# Altium schematic sheet Sheet1.SchDoc
size A3
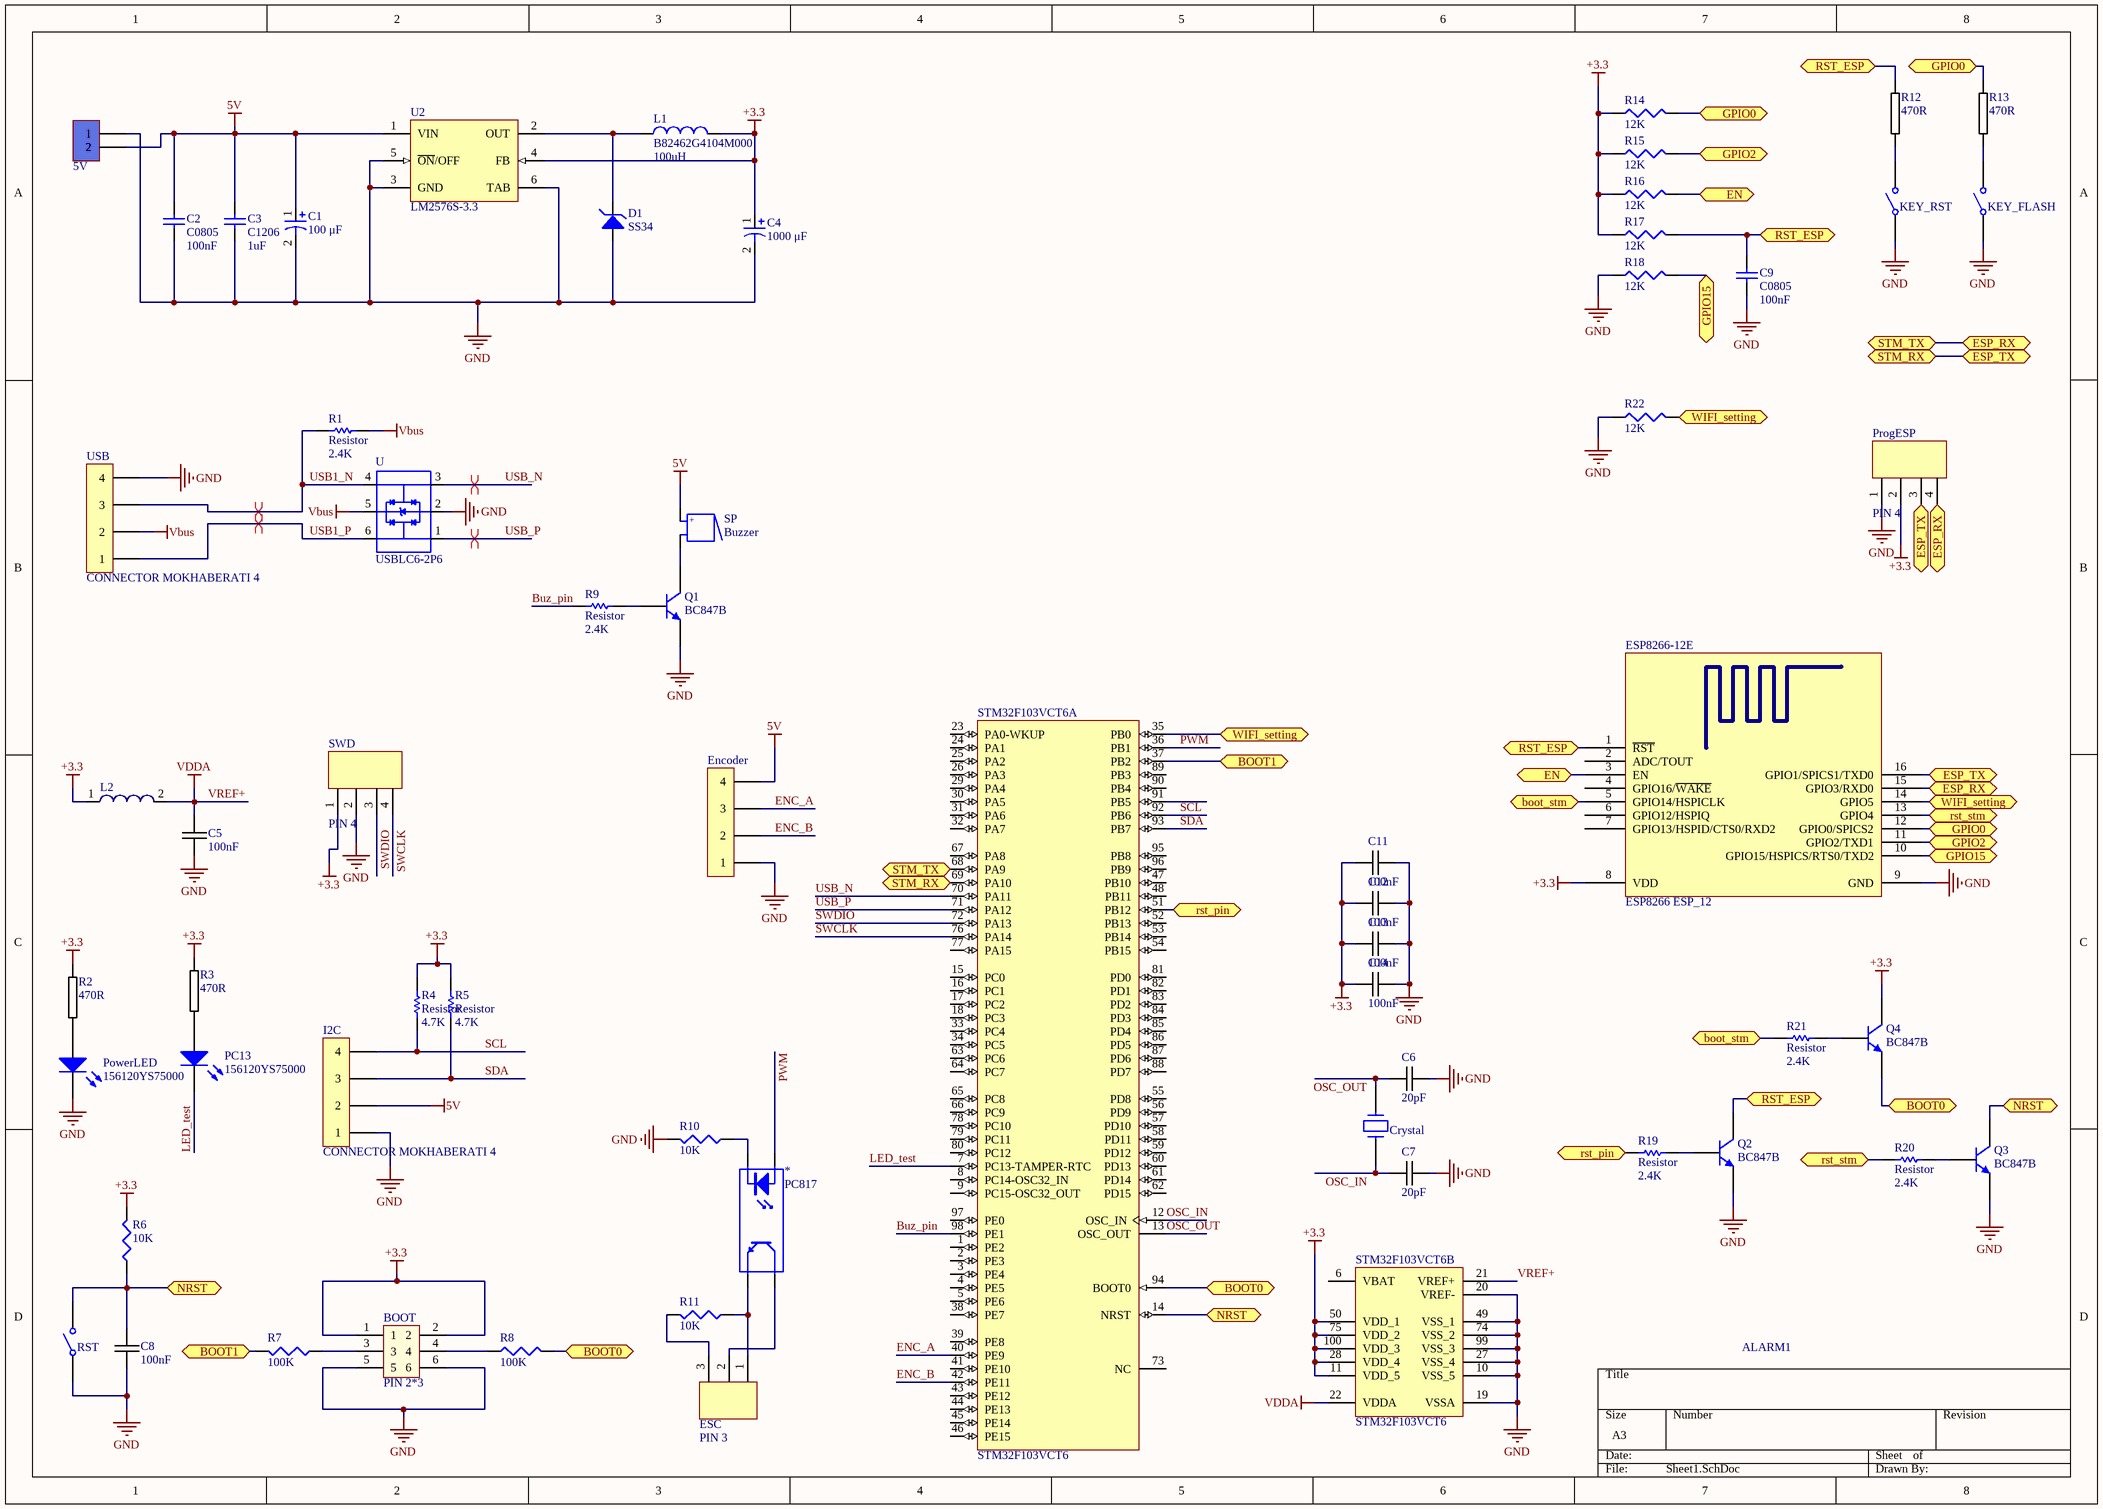
[diagram p0: Sheet1.SchDoc]

## Parts
5V  KF301-2Pin Terminal  [KF301 2PIN]  (value not drawn)
*  PC817  [PC817]
ALARM1  Warning!  [LOGO SPEAKER]  (value not drawn)  (no BOM)
BOOT  PIN 2*3  [PIN 2*3]
C1  100 μF  [WCAP-AS5H 8x10.5x3.1]
C2  C0805  value 100nF  [0805]
C3  C1206  value 1uF  [1206]
C4  1000 μF  [WCAP-AS5H 8x10.5x3.1]
C5  100nF  [0805C-TBD]
C6  20pF  [0603C-GENERIC]
C7  20pF  [0603C-GENERIC]
C8  100nF  [0805C-TBD]
C9  C0805  value 100nF  [0805]
C11  100nF  [0805C-TBD]
C12  100nF  [0805C-TBD]
C13  100nF  [0805C-TBD]
C14  100nF  [0805C-TBD]
Crystal  Crystal  [Crystal_1]  (value not drawn)
D1  SS34  [DO-214AC_Unidirectional]
Encoder  CONNECTOR MOKHABERATI 4  [CONNECTOR 4PIN]  (value not drawn)
ESC  PIN 3  [pin 3]
ESP8266-12E  ESP8266 ESP_12  [ESP8266 ESP_12]
I2C  CONNECTOR MOKHABERATI 4  [CONNECTOR 4PIN]
KEY_FLASH  WE-Tact Switches WS-TASV 434121043836  [434121043836]  (value not drawn)
KEY_RST  WE-Tact Switches WS-TASV 434121043836  [434121043836]  (value not drawn)
L1  B82462G4104M000  value 100uH  [B82462G4]
L2  32 Ohm  [SMD 1206]  (value not drawn)
PC13  156120YS75000  [1206  RECTANGULAR-REVERSE USE]
PowerLED  156120YS75000  [1206  RECTANGULAR-REVERSE USE]
ProgESP  PIN 4  [PIN F4]
Q1  BC847B  [SOT23_N]
Q2  BC847B  [SOT23_N]
Q3  BC847B  [SOT23_N]
Q4  BC847B  [SOT23_N]
R1  Resistor  value 2.4K  [Resistor_SMD_2010 (5025)]
R2  470R  [0603R-470]
R3  470R  [0603R-470]
R4  Resistor  value 4.7K  [Resistor_SMD_1206 (3216)]
R5  Resistor  value 4.7K  [Resistor_SMD_1206 (3216)]
R6  10K  [R 1206]
R7  100K  [R 1206]
R8  100K  [R 1206]
R9  Resistor  value 2.4K  [Resistor_SMD_2010 (5025)]
R10  10K  [R 1206]
R11  10K  [R 1206]
R12  470R  [0603R-470]
R13  470R  [0603R-470]
R14  12K  [R 1206]
R15  12K  [R 1206]
R16  12K  [R 1206]
R17  12K  [R 1206]
R18  12K  [R 1206]
R19  Resistor  value 2.4K  [Resistor_SMD_2010 (5025)]
R20  Resistor  value 2.4K  [Resistor_SMD_2010 (5025)]
R21  Resistor  value 2.4K  [Resistor_SMD_2010 (5025)]
R22  12K  [R 1206]
RST  WE-Tact Switches WS-TASV 434121043836  [434121043836]  (value not drawn)
SP  Buzzer  [BZ_SJ]
STM32F103VCT6  STM32F103VCT6  [STM-LQFP100_M]  (parts A,B of 2)
SWD  PIN 4  [pin 4]
U  USBLC6-2P6  [SOT50P160X60-6N]
U2  LM2576S-3.3  [TS5B_N]
USB  CONNECTOR MOKHABERATI 4  [CONNECTOR 4PIN]

## Ports
BOOT0, BOOT1, boot_stm, EN, ESP_RX, ESP_TX, GPIO0, GPIO2, GPIO15, NRST, RST_ESP, rst_pin, rst_stm, STM_RX, STM_TX, WIFI_setting

## Nets
5V: 5V.2 C1.1 C2.2 C3.2 Encoder.4 I2C.2 SP.1(+) U2.1(VIN)
+3.3: BOOT.1 BOOT.2 C4.1 C11.1 C12.1 C13.1 C14.1 ESP8266-12E.8(VDD) L1.2 L2.1 ProgESP.2 Q4.3(C) R2.1 R3.1 R4.2 R5.2 R6.2 R14.1 R15.1 R16.1 R17.1 STM32F103VCT6.11(VDD_5) STM32F103VCT6.28(VDD_4) STM32F103VCT6.50(VDD_1) STM32F103VCT6.75(VDD_2) STM32F103VCT6.100(VDD_3) SWD.1 U2.4(FB)
GND: 5V.1 BOOT.5 BOOT.6 C1.2 C2.1 C3.1 C4.2 C5.2 C6.2 C7.2 C8.2 C9.1 C11.2 C12.2 C13.2 C14.2 D1.2 Encoder.1 ESP8266-12E.9(GND) I2C.1 KEY_FLASH.1 KEY_RST.1 PowerLED.1(K) ProgESP.1 Q1.2(E) Q2.2(E) Q3.2(E) R10.2 R18.1 R22.1 RST.1 STM32F103VCT6.10(VSS_5) STM32F103VCT6.19(VSSA) STM32F103VCT6.20(VREF-) STM32F103VCT6.27(VSS_4) STM32F103VCT6.49(VSS_1) STM32F103VCT6.74(VSS_2) STM32F103VCT6.99(VSS_3) SWD.2 U.2(GND) U2.3(GND) U2.5(~{ON}/OFF) U2.6(TAB) USB.4
Vbus: R1.2 U.5(VBUS) USB.2
VREF+: C5.1 L2.2 STM32F103VCT6.21(VREF+) STM32F103VCT6.22(VDDA)  [also labelled VDDA]
BOOT0: Q4.2(E) R8.2 STM32F103VCT6.94(BOOT0) ; port BOOT0
BOOT1: R7.2 STM32F103VCT6.37(PB2) ; port BOOT1
boot_stm: ESP8266-12E.5(GPIO14/HSPICLK) R21.1 ; port boot_stm
Buz_pin: R9.1 STM32F103VCT6.98(PE1)
EN: ESP8266-12E.3(EN) R16.2 ; port EN
ENC_A: Encoder.3 STM32F103VCT6.40(PE9)
ENC_B: Encoder.2 STM32F103VCT6.42(PE11)
ESP_RX: ESP8266-12E.15(GPIO3/RXD0) ProgESP.4 STM32F103VCT6.68(PA9) ; port STM_TX, port ESP_RX
ESP_TX: ESP8266-12E.16(GPIO1/SPICS1/TXD0) ProgESP.3 STM32F103VCT6.69(PA10) ; port STM_RX, port ESP_TX
GPIO0: ESP8266-12E.12(GPIO0/SPICS2) R13.1 R14.2 ; port GPIO0
GPIO2: ESP8266-12E.11(GPIO2/TXD1) R15.2 ; port GPIO2
GPIO15: ESP8266-12E.10(GPIO15/HSPICS/RTS0/TXD2) R18.2 ; port GPIO15
LED_test: PC13.1(K) STM32F103VCT6.7(PC13-TAMPER-RTC)
NRST: C8.1 Q3.3(C) R6.1 RST.2 STM32F103VCT6.14(NRST) ; port NRST
OSC_IN: C7.1 Crystal.1 STM32F103VCT6.12(OSC_IN)
OSC_OUT: C6.1 Crystal.2 STM32F103VCT6.13(OSC_OUT)
PWM: *.1(A) STM32F103VCT6.36(PB1)
RST_ESP: C9.2 ESP8266-12E.1(~{RST}) Q2.3(C) R12.1 R17.2 ; port RST_ESP
rst_pin: R19.1 STM32F103VCT6.51(PB12) ; port rst_pin
rst_stm: ESP8266-12E.13(GPIO4) R20.1 ; port rst_stm
SCL: I2C.4 R4.1 STM32F103VCT6.92(PB6)
SDA: I2C.3 R5.1 STM32F103VCT6.93(PB7)
SWCLK: STM32F103VCT6.76(PA14) SWD.4
SWDIO: STM32F103VCT6.72(PA13) SWD.3
USB1_N: R1.1 U.4(I/O2_2) USB.3
USB1_P: U.6(I/O1_2) USB.1
USB_N: STM32F103VCT6.70(PA11) U.3(I/O2_1)
USB_P: STM32F103VCT6.71(PA12) U.1(I/O1_1)
WIFI_setting: ESP8266-12E.14(GPIO5) R22.2 STM32F103VCT6.35(PB0) ; port WIFI_setting
Net*_2: *.2(K) R10.1
Net*_3: *.3(E) ESC.1 R11.1
Net*_4: *.4(C) ESC.2
NetBOOT_3: BOOT.3 R7.1
NetBOOT_4: BOOT.4 R8.1
NetD1_1: D1.1 L1.1 U2.2(OUT)
NetESC_3: ESC.3 R11.2
NetKEY_FLASH_2: KEY_FLASH.2 R13.2
NetKEY_RST_2: KEY_RST.2 R12.2
NetPC13_2: PC13.2(A) R3.2
NetPowerLED_2: PowerLED.2(A) R2.2
NetQ1_1: Q1.1(B) R9.2
NetQ1_3: Q1.3(C) SP.2(-)
NetQ2_1: Q2.1(B) R19.2
NetQ3_1: Q3.1(B) R20.2
NetQ4_1: Q4.1(B) R21.2

Not connected (* = marked no-connect by the designer): ESP8266-12E 2(ADC/TOUT) 4(GPIO16/~{WAKE}) 6(GPIO12/HSPIQ) 7(GPIO13/HSPID/CTS0/RXD2); STM32F103VCT6 1(PE2) 2(PE3) 3(PE4) 4(PE5) 5(PE6) 6(VBAT) 8(PC14-OSC32_IN) 9(PC15-OSC32_OUT) 15(PC0) 16(PC1) 17(PC2) 18(PC3) 23(PA0-WKUP) 24(PA1) 25(PA2) 26(PA3) 29(PA4) 30(PA5) 31(PA6) 32(PA7) 33(PC4) 34(PC5) 38(PE7) 39(PE8) 41(PE10) 43(PE12) 44(PE13) 45(PE14) 46(PE15) 47(PB10) 48(PB11) 52(PB13) 53(PB14) 54(PB15) 55(PD8) 56(PD9) 57(PD10) 58(PD11) 59(PD12) 60(PD13) 61(PD14) 62(PD15) 63(PC6) 64(PC7) 65(PC8) 66(PC9) 67(PA8) 73(NC) 77(PA15) 78(PC10) 79(PC11) 80(PC12) 81(PD0) 82(PD1) 83(PD2) 84(PD3) 85(PD4) 86(PD5) 87(PD6) 88(PD7) 89(PB3) 90(PB4) 91(PB5) 95(PB8) 96(PB9) 97(PE0)

## Layout directives
differential pair: USB1_N, USB1_P, USB_N, USB_P

## Library data of the parts
5V = KF301-2Pin Terminal: Terminal 2 Pin 250VAC 16A; Part. No: KF301 2P; Designer: Abbas Basereh; Link: https://www.aliexpress.com/item/
ALARM1 = WARNING: Alarm Logo; Company: E.P.I.L; Design Date: 11/6/2011; Value: Warning!
C1 C4 = WCAP-AS5H 8x10.5x3.1 865230253005: WCAP-AS5H Aluminum Electrolytic Capacitors , 220 μF; + / - 20%; 10 V , 8 x 10,5; Manufacturer: Wurth Elektronik; E-mail: libraries@we-online.com; Characteristics: Aluminum Electrolytic Capacitor; Recommended soldering: Reflow; Operating temperature: –40 °C to +105 °C; Long life product series; Load life: 5000 h @ +105 °C; ComponentLink1Description: Manufacturer; ComponentLink1URL: http://www.we-online.com; ComponentLink2Description: Datasheet; ComponentLink2URL: http://katalog.we-online.de/pbs/datasheet/865230253005.pdf; Created by: Karrer Zheng; Created Date: 6/12/2015; Application: Applied to circuit with higher requirements for long life, and can be use for filtering in switching power supply, DC-DC power supply module,conversion adapter, charger, DC motor circuit filter, digital audio, digital TV, digital camera, digital video camera, satellite receivers, equipment control panel power supply and etc.; partNo: 865230253005
  C1: Capacitance: 100 μF
  C4: Capacitance: 1000 μF
C2 C9 = C0805: Ceramic Chip Capacitor - Standard; Note: Footprint corresponds to dimensions for bulk cassette packaging. This case size has tightened tolerances.; Published: 17-Jul-2002; LatestRevisionDate: 19-Mar-2004; LatestRevisionNote: Silkscreen size reduced.; DatasheetDocument: Mar-2001; PackageDocument: Mar-2001; PackageReference: 0805; Publisher: Altium Limited; Code_JEITA: 0805; Code_IPC: 2012[0805]; ComponentLink1Description: Manufacturer Link; ComponentLink1URL: http://www.kemet.com/; ComponentLink2Description: Datasheet; ComponentLink2URL: http://www.kemet.com/kemet/web/homepage/kechome.nsf/vapubfilesname/F3102TA.pdf/$file/F3102TA.pdf
C3 = C1206: Ceramic Chip Capacitor - Standard; Published: 17-Jul-2002; LatestRevisionDate: 19-Mar-2004; LatestRevisionNote: Silkscreen size reduced.; DatasheetDocument: Mar-2001; PackageDocument: Mar-2001; PackageReference: 1206; Publisher: Altium Limited; Code_JEITA: 1206; Code_IPC: 3216 [1206]; ComponentLink1Description: Manufacturer Link; ComponentLink1URL: http://www.kemet.com/; ComponentLink2Description: Datasheet; ComponentLink2URL: http://www.kemet.com/kemet/web/homepage/kechome.nsf/vapubfilesname/F3102TA.pdf/$file/F3102TA.pdf
C5 C8 C11-C14 = 0805C-100nF-25V-X7R-MUR: CAPACITOR 0805 CERAMIC; Supplier 1: Digi-Key; Supplier Part Number 1: 490-1673-1-ND
C6 C7 = 0603C-000: CAPACITOR 0603 CERAMIC
Crystal = Crystal..: LatestRevisionDate: 17-Jul-2002; LatestRevisionNote: Re-released for DXP Platform.; Publisher: Altium Limited
D1 = TVS Diode, Unidirectional DO-214AC, 824500101: WE-TVSP Power TVS Diode, Unidirectional, 400 W, 10 VDC; Manufacturer: Wurth Elektronik; partNo: 824500101; ComponentLink1Description: Manufacturer; ComponentLink1URL: http://www.we-online.de; Created by: Baojun Chen; Created Date: Nov.2015; ComponentLink2Description: Datasheet; ComponentLink2URL: http://katalog.we-online.de/pbs/datasheet/824500101.pdf
ESP8266-12E = ESP8266 ESP_12: ESP8266 ESP-12; IC: ESP8266-EX; Vendor: Ai-thinker; LatestReviewer: Zion Blue; Published: 14-Apr-2015; Publisher: Cynetik Group; LatestRevisionData: 14-Apr-2015; LatestRevisionNote: Include 3D body and Footprint
KEY_FLASH KEY_RST RST = WE-Tact Switches WS-TASV 434121043836: WS-TASV SMD Tact Switch 6.0X3.5 mm; Manufacturer: W¨¹rth Elektronik eiSos GmbH & Co.KG; ComponentLink1 Description: Manufacturer; ComponentLink2 Description: Datasheet; Creat by: Karrer Zheng; NoPins: 02; Creat Date: 5 March February 2014; partNo: 434121043836; ComponentLink1URL: http://www.we-online.com; ComponentLink2URL: http://katalog.we-online.de/em/datasheet/434121043836.pdf
L1 = B82462G4104M000: SMT Power Inductor; Size 6.3×6.3×3.0mm, ±20% Tolerance, 100uH, 0.53A; PCB_Layout: Complies with manufacturer's recommendation.; Published: 26-Sep-2008; DatasheetVersion: Mar-2008; PackageVersion: Mar-2008; PackageReference: B82462G4; Publisher: Altium Limited; PackageDescription: SM Power Inductor; 2 Leads; Body 6.3 x 6.3 x 3.0 mm (LxWxH); ComponentLink1Description: Manufacturer Link; ComponentLink1URL: http://www.epcos.com/; ComponentLink2Description: Datasheet; ComponentLink2URL: http://www.epcos.com/inf/30/db/ind_2008/b82462g4.pdf
L2 = WE-CBF 1206, 7427921: SMD EMI Suppression Ferrite Beads WE-CBF, Z= 32 Ohm; Manufacturer: Würth Elektronik eiSos GmbH; partNo: 7427921; Impedance: 32 Ohm; ComponentLink1Description: Manufacturer; ComponentLink1URL: http://www.we-online.de; Created by: Christin Zierenner; Created Date: May 2009; ComponentLink2Description: Datasheet; ComponentLink2URL: http://www.we-online.de/katalog/media/pdf/7427921.pdf
PC13 PowerLED = WL-SMRW 1206  156120YS75000  Reverse Use: SMD mono-color reverse mount waterclear Chip LED, WL-SMRW, Yellow; Manufacturer: Würth Elektronik eiSos GmbH; Lens Type: Rectangular; PartNo: 156120YS75000; ComponentLink1Description: Manufacturer; ComponentLink1URL: http://www.we-online.de; Created by: Christin Otto; Created Date: June 2013; ComponentLink2Description: Datasheet; ComponentLink2URL: http://katalog.we-online.com/led/datasheet/156120YS75000.pdf; Color: Yellow
Q1-Q4 = BC847B: NPN General-purpose Transistor; Published: 17-Sep-2003; LatestRevisionDate: 12-Dec-2006; LatestRevisionNote: IPC-7351 Footprint Added.; DatasheetVersion: 4-Feb-2002; PackageVersion: May-1999; PackageReference: SOT23; Publisher: Altium Limited; PackageDescription: 3-Pin SOT-23 Package 0.95 mm Pitch, 2.3 mm Lead Span; ComponentLink1Description: Manufacturer Link; ComponentLink1URL: http://www.semiconductors.philips.com/; ComponentLink2Description: Datasheet; ComponentLink2URL: http://www.semiconductors.philips.com/acrobat/datasheets/BC846_BC847_BC848_5.pdf
R1 R4 R5 R9 R19-R21 = Resistor: Email: razi.vesali@gmail.com; Published: 17-Jun-2016; LatestRevisionNote: Re-released for puplic; Publisher: Seyed Razi Vesali
R2 R3 R12 R13 = 0603R-470: GENERIC RESISTOR 0603; Manufacturer Part Number: RMCF 1/16 470 1% R; Manufacturer: Stackpole Electronics Inc; Tolerance: ±1%; Power (Watts): 0.1W, 1/10W; Temperature Coefficient: ±100ppm/°C; Resistance In Ohms: 470; Reel: R17; Supplier 1: Digi-Key; Supplier Part Number 1: RMCF1/16470FRTR-ND; Supplier: Digi-Key; Composition: Thick Film; Packaging: Tape & Reel (TR); Lead Style: Surface Mount (SMD - SMT); Category: Resistors; RoHS: RoHS Compliant; Supplier Part Number: RMCF1/16470FRTR-ND; Case: 0603 (1608 metric)
R6-R8 R10 R11 R14-R18 R22 = R 1206
SP = Buzzer: Magnetic Transducer Buzzer; Company: SJ Libraries; Designer: Eng. Saeid Jorablo; PackageReference: ABSM-1574; PackageDescription: Magnetic Transducer Buzzer; Mounting Technology: Surface Mount\Through-Hole; ComponentLink1Description: Datasheet; Pin Count: 0; Category: MISC; HelpURL: http://s3.picofile.com/file/7443264187/Coming_Soon_logo.gif; ComponentLink2Description: Reference; Publisher: SJ Unlimited; Status: Unreleased
STM32F103VCT6 = STM32F103VCT6: ARM Cortex-M3 32-bit MCU, 256 KB Flash, 48 KB Internal RAM, 80 I/Os, 100-pin LQFP, -40 to 85 degC, Tray; A/D Converter: 3x12-bit (16 Channel); D/A Converter: 2x12-bit (2 Channel); FLASH Size (Prog) (kB): 256; I/Os (High Current): 80; Internal RAM Size (kB): 48; Operating Frequency(F) (Processor speed) (MHz): 72; Supply Voltage(Vcc) min (V): 2; DatasheetVersion: Rev. 8; PackageVersion: Rev. 1, 06/2013; PackageReference: LQFP100; PackageDescription: 100-Pin Low Profile Quad Flat Package, 14 x 14 mm Body, 0.5 mm Pitch; Supplier 1: Digi-Key; Supplier Part Number 1: 497-9034-ND; Supplier 2: Farnell; Supplier Part Number 2: 1624139; Supplier 3: Newark; Supplier Part Number 3: 57P1255; Supplier 4: Mouser; Supplier Part Number 4: 511-STM32F103VCT6; Core: ARM Cortex-M3; Packing: Tray; Mounting Technology: Surface Mount; PartNumber: STM32F103VCT6; ComponentLink1Description: Manufacturer URL; ComponentLink1URL: http://www.st.com/web/en/home.html; ComponentLink2Description: Datasheet; ComponentLink2URL: http://www.st.com/st-web-ui/static/active/en/resource/technical/document/datasheet/CD00191185.pdf; ComponentLink3Description: Package Specification; ComponentLink3URL: http://www.st.com/st-web-ui/static/active/en/resource/technical/document/data_brief/DM00071938.pdf
U = USBLC6-2P6: 17V Clamp 5A _8/20Âµs_ Ipp Tvs Diode Surface Mount SOT-666; MF: STMicroelectronics; Value: *; MP: USBLC6-2P6; SnapEDA_Link: https://www.snapeda.com/parts/USBLC6-2P6/STMicroelectronics/view-part/106846/?ref=snap; Availability: Unavailable; Price: None; Package: SOT-563 STMicroelectronics
U2 = LM2576S-3.3: SIMPLE SWITCHER; 3A Step-Down Voltage Regulator; Manufacturer: National Semiconductor; PackageTopMarking: NSUZXYTT*LM2576S*-3.3 P+; PowerWise: N; FirstPublished: 4-Dec-2008; DatasheetVersion: Aug-2004; PackageVersion: revD, Apr-2005; PackageReference: TS5B; Publisher: Altium Limited; PackageDescription: TO-263, Molded, .400 x .390 x .180in, 5 Lead, .067in Pitch, Surface Mount; CompType: Switcher; PartNumber: LM2576S-3.3; RoHS: Y; PinCount: 5; DigiKeyPartNumber: LM2576S-3.3-ND; Code_JEDEC: MO-169-AB; ComponentLink1Description: LM2576 Datasheet; ComponentLink1URL: http://www.national.com/ds/LM/LM2576.pdf; ComponentLink2Description: LM2576 Web Page; ComponentLink2URL: http://www.national.com/pf/LM/LM2576.html; ComponentLink3Description: TS5B Package Page; ComponentLink3URL: http://www.national.com/packaging/folders/ts5b.html